# EAGLE design arduino (EAGLE 6.1)
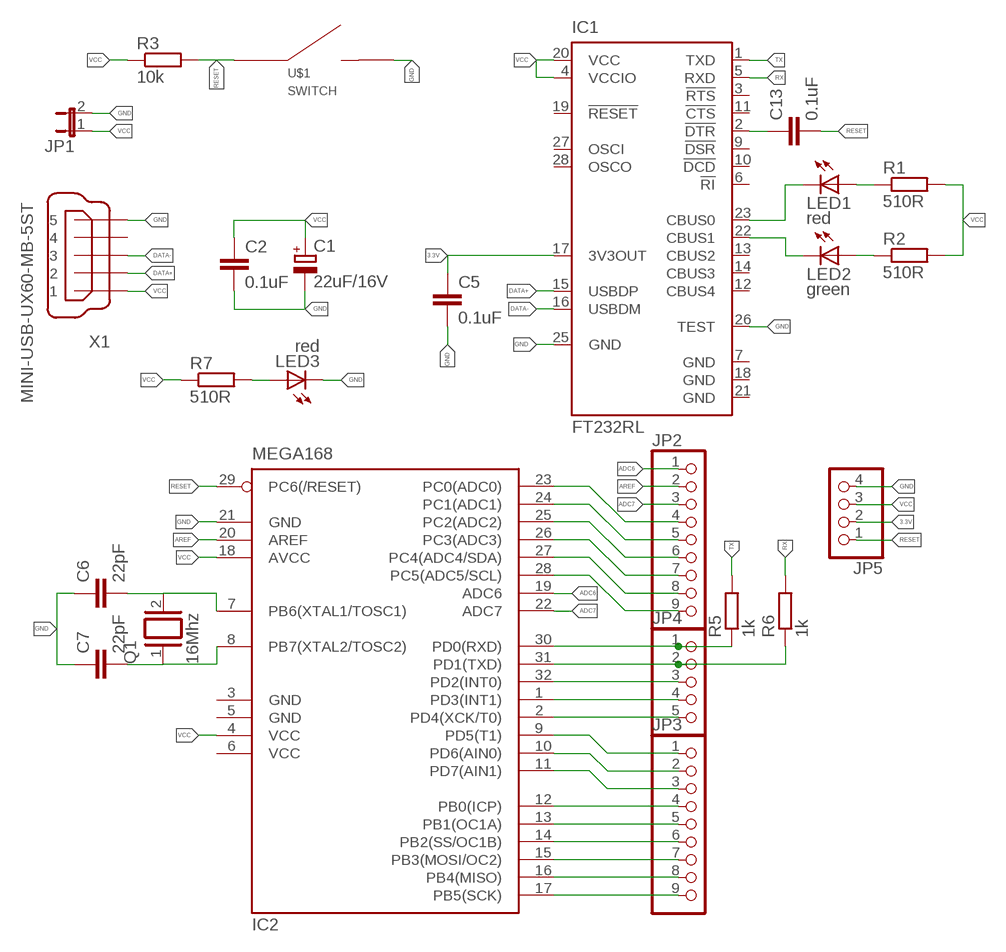
[diagram p0: schematic, sheet 1]

## Parts
C1  22uF/16V  CPOL-EUE2-5  [E2-5]
C2  0.1uF  C-EUC0805K  [C0805K]
C5  0.1uF  C-EUC0805K  [C0805K]
C6  22pF  C-EUC0805K  [C0805K]
C7  22pF  C-EUC0805K  [C0805K]
C13  0.1uF  C-EUC0805K  [C0805K]
IC1  FT232RL  [SSOP28]
IC2  MEGA168  MEGA8-AI  [TQFP32-08]
JP1  JP1E  [JP1]
JP2  PINHD-1X9  [1X09]
JP3  PINHD-1X9  [1X09]
JP4  PINHD-1X5  [1X05]
JP5  PINHD-1X4  [1X04]
LED1  red  LEDCHIPLED_1206  [CHIPLED_1206]
LED2  green  LEDCHIPLED_1206  [CHIPLED_1206]
LED3  red  LEDCHIPLED_1206  [CHIPLED_1206]
Q1  16Mhz  XTAL/S  [QS]
R1  510R  R-EU_R0805W  [R0805W]
R2  510R  R-EU_R0805W  [R0805W]
R3  10k  R-EU_R0805W  [R0805W]
R5  1k  R-EU_R0805W  [R0805W]
R6  1k  R-EU_R0805W  [R0805W]
R7  510R  R-EU_R0805W  [R0805W]
U$1  SWITCH  [SWITCH]
X1  MINI-USB-UX60-MB-5ST  [UX60-MB-5ST]

## Nets
3.3V: C5.1 IC1.17(3V3OUT) JP5.2
ADC6: IC2.19(ADC6) JP2.1
ADC7: IC2.22(ADC7) JP2.3
AREF: IC2.20(AREF) JP2.2
DATA+: IC1.15(USBDP) X1.2
DATA-: IC1.16(USBDM) X1.3
GND: C1.- C2.2 C5.2 C6.1 C7.1 IC1.25(GND) IC1.26(TEST) IC2.21(GND) JP1.2 JP5.4 LED3.C U$1.P2 X1.5
N$1: IC1.22(CBUS1) LED2.C
N$2: IC1.23(CBUS0) LED1.C
N$3: LED1.A R1.1
N$4: LED2.A R2.1
N$5: C13.1 IC1.2(!DTR)
N$6: C6.2 IC2.7(PB6(XTAL1/TOSC1)) Q1.2
N$7: C7.2 IC2.8(PB7(XTAL2/TOSC2)) Q1.1
N$8: IC2.23(PC0(ADC0)) JP2.4
N$9: IC2.30(PD0(RXD)) JP4.1 R5.1
N$10: IC2.31(PD1(TXD)) JP4.2 R6.1
N$11: LED3.A R7.2
N$12: IC2.24(PC1(ADC1)) JP2.5
N$13: IC2.25(PC2(ADC2)) JP2.6
N$14: IC2.26(PC3(ADC3)) JP2.7
N$15: IC2.27(PC4(ADC4/SDA)) JP2.8
N$16: IC2.28(PC5(ADC5/SCL)) JP2.9
N$17: IC2.11(PD7(AIN1)) JP3.3
N$18: IC2.10(PD6(AIN0)) JP3.2
N$19: IC2.12(PB0(ICP)) JP3.4
N$20: IC2.13(PB1(OC1A)) JP3.5
N$21: IC2.14(PB2(SS/OC1B)) JP3.6
N$22: IC2.15(PB3(MOSI/OC2)) JP3.7
N$23: IC2.16(PB4(MISO)) JP3.8
N$24: IC2.17(PB5(SCK)) JP3.9
N$25: IC2.9(PD5(T1)) JP3.1
N$27: IC2.32(PD2(INT0)) JP4.3
N$28: IC2.1(PD3(INT1)) JP4.4
N$29: IC2.2(PD4(XCK/T0)) JP4.5
RESET: C13.2 IC2.29(PC6(/RESET)) JP5.1 R3.2 U$1.P1
RX: IC1.5(RXD) R6.2
TX: IC1.1(TXD) R5.2
VCC: C1.+ C2.1 IC1.4(VCCIO) IC1.20(VCC) IC2.4(VCC) IC2.18(AVCC) JP1.1 JP5.3 R1.2 R2.2 R3.1 R7.1 X1.1
Unconnected: IC1.3(!RTS) IC1.6(!RI) IC1.9(!DSR) IC1.10(!DCD) IC1.11(!CTS) IC1.12(CBUS4) IC1.13(CBUS2) IC1.14(CBUS3) IC1.19(!RESET) IC1.27(OSCI) IC1.28(OSCO) X1.4

## Power pins joined to a net without a drawn wire
GND: IC1.7(GND) IC1.18(GND) IC1.21(GND) IC2.3(GND) IC2.5(GND)
VCC: IC2.6(VCC)

## Library data of the parts
C1 = resistor:CPOL-EU: POLARIZED CAPACITOR, European symbol
C2 C5-C7 C13 = resistor:C-EU: CAPACITOR, European symbol
IC1 = ftdichip:FT232R: Source: http://www.ftdichip.com/Documents/DataSheets/DS_FT232R_v104.pdf; MPN: FT232RL; OC_FARNELL: 1146032; OC_NEWARK: 91K9918
IC2 = atmel:MEGA8: MICROCONTROLLER 8 Kbytes FLASH, 1 kbytes SRAM, 512 bytes EEPROM, USART, 6-channel 10 bit ADC, 2-channel 8 bit ADC Pin compatible with Atmega48, ATMega88, ATMega168 Source: avr.lbr; MPN: ATMEGA8-16AU; OC_FARNELL: 9171371; OC_NEWARK: 73M8863
JP1 = jumper:JP1E: JUMPER
JP2 JP3 = pinhead:PINHD-1X9: PIN HEADER
JP4 = pinhead:PINHD-1X5: PIN HEADER
JP5 = pinhead:PINHD-1X4: PIN HEADER
LED1-LED3 = led:LED: LED OSRAM: - CHIPLED LG R971, LG N971, LY N971, LG Q971, LY Q971, LO R971, LY R971 LH N974, LH R974 LS Q976, LO Q976, LY Q976 LO Q996 - Hyper CHIPLED LW Q18S LB Q993, LB Q99A, LB R99A - SideLED LS A670, LO A670, LY A670, LG A670, LP A670 LB A673, LV A673, LT A673, LW A673 LH A674 LY A675 LS A676, LA A676, LO A676, LY A676, LW A676 LS A679, LY A679, LG A679 - Hyper Micro SIDELED® LS Y876, LA Y876, LO Y876, LY Y876 LT Y87S - SmartLED LW L88C, LW L88S LB L89C, LB L89S, LG L890 LS L89K, LO L89K, LY L89K LS L896, LA L896, LO L896, LY L896 - TOPLED LS T670, LO T670, LY T670, LG T670, LP T670 LSG T670, LSP T670, LSY T670, LOP T670, LYG T670 LG T671, LOG T671, LSG T671 LB T673, LV T673, LT T673, LW T673 LH T674 LS T676, LA T676, LO T676, LY T676, LB T676, LH T676, LSB T676, LW T676 LB T67C, LV T67C, LT T67C, LS T67K, LO T67K, LY T67K, LW E67C LS E67B, LA E67B, LO E67B, LY E67B, LB E67C, LV E67C, LT E67C LW T67C LS T679, LY T679, LG T679 LS T770, LO T770, LY T770, LG T770, LP T770 LB T773, LV T773, LT T773, LW T773 LH T774 LS E675, LA E675, LY E675, LS T675 LS T776, LA T776, LO T776, LY T776, LB T776 LHGB T686 LT T68C, LB T68C - Hyper Mini TOPLED® LB M676 - Mini TOPLED Santana® LG M470 LS M47K, LO M47K, LY M47K Source: http://www.osram.convergy.de LUXEON: - LUMILED® LXK2-PW12-R00, LXK2-PW12-S00, LXK2-PW14-U00, LXK2-PW14-V00 LXK2-PM12-R00, LXK2-PM12-S00, LXK2-PM14-U00 LXK2-PE12-Q00, LXK2-PE12-R00, LXK2-PE12-S00, LXK2-PE14-T00, LXK2-PE14-U00 LXK2-PB12-K00, LXK2-PB12-L00, LXK2-PB12-M00, LXK2-PB14-N00, LXK2-PB14-P00, LXK2-PB14-Q00 LXK2-PR12-L00, LXK2-PR12-M00, LXK2-PR14-Q00, LXK2-PR14-R00 LXK2-PD12-Q00, LXK2-PD12-R00, LXK2-PD12-S00 LXK2-PH12-R00, LXK2-PH12-S00 LXK2-PL12-P00, LXK2-PL12-Q00, LXK2-PL12-R00 Source: www.luxeon.com KINGBRIGHT: KA-3528ASYC Source: www.kingbright.com
Q1 = special:XTAL/S: CRYSTAL
R1-R3 R5-R7 = resistor:R-EU_: RESISTOR, European symbol
U$1 = switch:SWITCH
X1 = con-hirose:MINI-USB-: MINI USB Connector Source: http://www.hirose.co.jp/cataloge_hp/e24000019.pdf; OC_FARNELL: unknown; OC_NEWARK: unknown

## Board
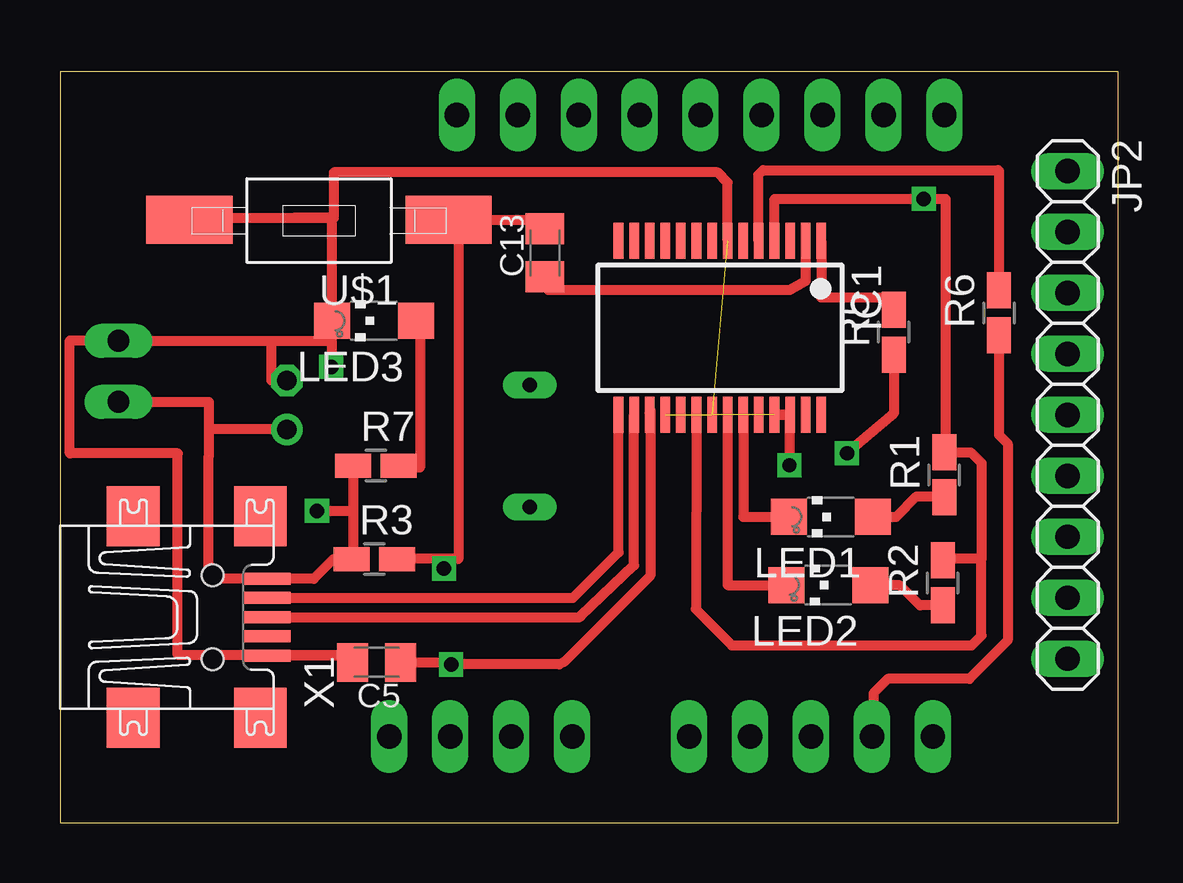
[diagram p1: board, top side]
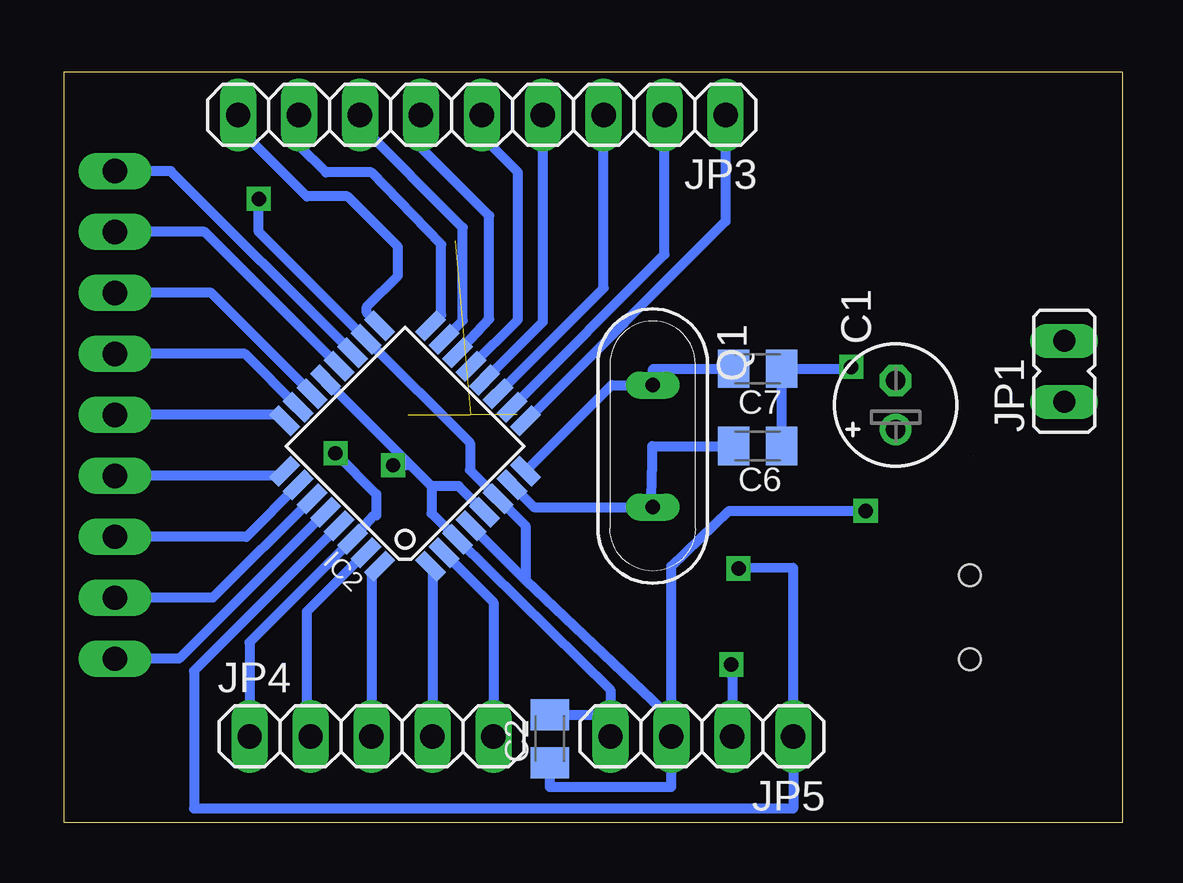
[diagram p2: board, bottom side, seen from below]

Size 44.1 x 31.3 mm. Coordinates in mm from the lower left corner, seen from the top.
Outline: 0,0 44.1,0 44.1,31.3 0,31.3 0,0
Copper layers (1*16): Top 0.035mm / dielectric 1.5mm / Bottom 0.035mm
Design rules: minimum track width 10mil, minimum drill 24mil, track to track 8mil, track to pad 8mil, pad to pad 8mil, via to via 8mil, smd to smd 8mil, copper to edge 40mil, drill to drill 8mil, minimum pad ring 10mil, minimum via ring 8mil, stop-mask expansion 4mil, vias tented up to drill 0mil, thermal gap 10mil

### Footprints (pad centres in the part's own frame; a part is rotated, then mirrored left to right if it is on the bottom)
E2-5 = drill 0.813 pad 1.27: + -1.016,0 | drill 0.813 pad 1.27 octagon: - 1.016,0
C0805K = smd 1.3 x 1.6: 1 -1,0; 2 1,0
SSOP28 = smd 0.4 x 1.5: 1 -4.225,-3.625; 2 -3.575,-3.625; 3 -2.925,-3.625; 4 -2.275,-3.625; 5 -1.625,-3.625; 6 -0.975,-3.625; 7 -0.325,-3.625; 8 0.325,-3.625; 9 0.975,-3.625; 10 1.625,-3.625; 11 2.275,-3.625; 12 2.925,-3.625; 13 3.575,-3.625; 14 4.225,-3.625; 15 4.225,3.625; 16 3.575,3.625; 17 2.925,3.625; 18 2.275,3.625; 19 1.625,3.625; 20 0.975,3.625; 21 0.325,3.625; 22 -0.325,3.625; 23 -0.975,3.625; 24 -1.625,3.625; 25 -2.275,3.625; 26 -2.925,3.625; 27 -3.575,3.625; 28 -4.225,3.625
TQFP32-08 = smd 1.27 x 0.559: 1 -4.293,2.8; 2 -4.293,2; 3 -4.293,1.2; 4 -4.293,0.4; 5 -4.293,-0.4; 6 -4.293,-1.2; 7 -4.293,-2; 8 -4.293,-2.8; 17 4.293,-2.8; 18 4.293,-2; 19 4.293,-1.2; 20 4.293,-0.4; 21 4.293,0.4; 22 4.293,1.2; 23 4.293,2; 24 4.293,2.8 | smd 0.559 x 1.27: 9 -2.8,-4.293; 10 -2,-4.293; 11 -1.2,-4.293; 12 -0.4,-4.293; 13 0.4,-4.293; 14 1.2,-4.293; 15 2,-4.293; 16 2.8,-4.293; 25 2.8,4.293; 26 2,4.293; 27 1.2,4.293; 28 0.4,4.293; 29 -0.4,4.293; 30 -1.2,4.293; 31 -2,4.293; 32 -2.8,4.293
JP1 = drill 0.914 long: 1 0,-1.27; 2 0,1.27
1X09 = drill 1.016 long: 1 -10.16,0; 2 -7.62,0; 3 -5.08,0; 4 -2.54,0; 5 0,0; 6 2.54,0; 7 5.08,0; 8 7.62,0; 9 10.16,0
1X05 = drill 1.016 long: 1 -5.08,0; 2 -2.54,0; 3 0,0; 4 2.54,0; 5 5.08,0
1X04 = drill 1.016 long: 1 -3.81,0; 2 -1.27,0; 3 1.27,0; 4 3.81,0
CHIPLED_1206 = smd 1.5 x 1.5: A 0,-1.75; C 0,1.75
QS = drill 0.61 long: 1 -2.54,0; 2 2.54,0
R0805W = smd 1.5 x 1: 1 -0.94,0; 2 0.94,0
SWITCH = smd 3.6 x 2: P1 -5.4,-0.1; P2 5.4,-0.1
UX60-MB-5ST = smd 2 x 0.5: 1 2.25,1.6; 2 2.25,0.8; 3 2.25,0; 4 2.25,-0.8; 5 2.25,-1.6 | smd 2.2 x 2.5: M1 -3.3,-4.2; M2 -3.3,4.2; M3 2,4.2; M4 2,-4.2 | hole 0.9: 0,-1.75; 0,1.75

### Placement (x,y rotation side)
C1  9.45,17.41 90 bottom
C2  23.87,3.51 90 bottom
C5  13.19,6.69 180 top
C6  15.2,15.7 180 bottom
C7  15.2,18.92 180 bottom
C13  20.21,23.75 90 top
IC1  27.5,20.63 180 top
IC2  29.9,15.7 135 bottom
JP1  2.43,18.81 0 bottom
JP2  42,17 270 top
JP3  26.7,29.5 180 bottom
JP4  31.3,3.6 0 bottom
JP5  17.53,3.6 180 bottom
LED1  32.12,12.75 90 top
LED2  32.02,9.91 90 top
LED3  13.08,20.92 90 top
Q1  19.58,15.7 270 bottom
R1  36.85,14.5 90 top
R2  36.79,10 90 top
R3  13.1,10.99 0 top
R5  34.75,20.45 90 top
R6  39.13,21.25 90 top
R7  13.16,14.89 0 top
U$1  10.79,25.04 180 top
X1  6.35,8.57 0 top

### Tracks (layer width: path | path; a pad name or v marks a point on that pad's centre or on a via)
3.3V  (via drill 0.6)
  Top 0.406: IC1.17 24.6,17.2 24.6,10.3 21,6.7 20.8,6.6 v16.3,6.6 16.3,6.69 | C5.1 16.3,6.69 | 16.3,6.69 16.39,6.69 16.4,6.7
  Bottom 0.406: v16.3,6.6 16.26,6.1 JP5.2
ADC6
  Bottom 0.406: IC2.19 39.66,27.16 JP2.1
ADC7
  Bottom 0.406: IC2.22 37.98,22.08 JP2.3
AREF
  Bottom 0.406: IC2.20 38.25,24.62 JP2.2
DATA+
  Top 0.406: IC1.15 23.27,11.28 21.37,9.37 X1.2
DATA-
  Top 0.406: IC1.16 23.93,10.72 21.7,8.6 21.67,8.57 X1.3
GND  (via drill 0.6)  (3 unrouted)
  Top 0.406: IC1.26 IC1.25 30.4,17 v30.4,14.9 | X1.5 11.78,6.99 | 11.78,6.99 C5.2 | IC1.7 27.82,26.68 27.4,27.1 11.4,27.1 11.4,25.2 8.1,25.2 | 8.1,25.2 5.45,25.2 U$1.P2 | 8.1,25.2 11.33,25.23 LED3.C 11.33,20.08 | 8.8,20.08 JP1.2 3.73,20.1 0.4,20.1 0.4,15.4 4.9,15.4 4.9,6.99 11.78,6.99 | 8.8,20.08 8.8,18.43 C1.- | 8.8,20.08 11.33,20.08 | v11.3,19 11.33,19 11.33,20.08
  Bottom 0.406: IC2.21 29.67,14.9 | 28.8,14.03 28.8,12.9 IC2.3 21.34,5.54 JP5.4 21.74,4.51 C2.2 | IC2.5 27.67,14.03 28.8,14.03 | C6.1 C7.1 11.3,18.92 v11.3,19 | v30.4,14.9 29.9,14.9 | 29.9,14.9 29.9,15.1 | 28.8,14.03 29.67,14.9 | 29.67,14.9 29.9,14.9
N$1
  Top 0.406: IC1.22 27.82,9.91 LED2.C
N$2
  Top 0.406: IC1.23 28.48,12.75 LED1.C
N$3
  Top 0.406: LED1.A 34.85,12.75 35.7,13.6 36.89,13.6 | 36.9,13.6 36.89,13.6 | 36.89,13.6 R1.1
N$4
  Top 0.406: R2.1 35.84,9.06 35,9.9 LED2.A
N$5
  Top 0.406: IC1.2 31.07,22.57 30.4,22.2 20.34,22.2 C13.1
N$6
  Bottom 0.406: IC2.7 24.53,13.16 Q1.2 19.62,13.2 19.6,14.7 19.6,15.7 C6.2
N$7
  Bottom 0.406: IC2.8 21.29,18.24 Q1.1 19.56,18.92 C7.2
N$8
  Bottom 0.406: IC2.23 36.57,19.54 JP2.4
N$9  (via drill 0.6)
  Top 0.406: R5.1 34.75,17.05 v32.8,15.4
  Bottom 0.406: JP4.1 36.38,7.52 IC2.30 31.2,12.8 31.1,12.8 31.1,13.7 v32.8,15.4
N$10
  Top 0.406: R6.1 39.13,16.17 39.5,15.8 39.5,7.6 37.9,6 34.5,6 33.9,5.4 33.9,3.66 JP4.2
  Bottom 0.406: IC2.31 31.55,11.25 34,8.8 34,3.76 JP4.2
N$11
  Top 0.406: LED3.A 15,21.42 15,14.8 14.1,14.8 R7.2
N$12
  Bottom 0.406: IC2.24 35.16,17 JP2.5
N$13
  Bottom 0.406: IC2.25 35.1,14.46 JP2.6
N$14
  Bottom 0.406: IC2.26 36.51,11.92 JP2.7
N$15
  Bottom 0.406: IC2.27 37.92,9.38 JP2.8
N$16
  Bottom 0.406: IC2.28 39.33,6.84 JP2.9
N$17
  Bottom 0.406: IC2.11 21.62,22.28 JP3.3
N$18
  Bottom 0.406: IC2.10 19.08,23.69 JP3.2
N$19
  Bottom 0.406: IC2.12 24.16,20.87 JP3.4
N$20
  Bottom 0.406: IC2.13 25.2,20.97 25.2,27.1 26.7,28.6 JP3.5
N$21
  Bottom 0.406: IC2.14 26.4,21 26.4,25.3 29.24,28.14 JP3.6
N$22
  Bottom 0.406: IC2.15 27.5,20.93 27.5,24.8 31.8,29.1 31.8,29.48 JP3.7
N$23
  Bottom 0.406: IC2.16 28.4,21.16 28.4,24.1 31.3,27.1 33.2,27.1 34.32,28.22 JP3.8
N$24
  Bottom 0.406: IC2.17 31.5,21.26 31.5,21.5 30.2,22.8 30.2,24 32.3,26.1 34,26.1 36.9,29 36.9,29.5 JP3.9
N$25
  Bottom 0.406: JP3.1 16.54,25.06 24.9,16.7 24.9,16.74 IC2.9
N$27
  Bottom 0.406: IC2.32 31.3,10.34 JP4.3
N$28
  Bottom 0.406: IC2.1 28.76,10.6 JP4.4
N$29
  Bottom 0.406: IC2.2 26.22,9.19 JP4.5
RESET  (via drill 0.6)
  Top 0.406: C13.2 19.91,24.49 19.9,24.5 19.84,25.14 U$1.P1 16.6,25.14 16.6,11 16,11 | v16,10.6 16,11 | 16,11 14.1,11 | 14.1,11 R3.2 14.04,10.96 14.1,10.9 14.1,11
  Bottom 0.406: IC2.29 38.7,6.33 38.7,0.6 13.72,0.6 JP5.1 13.72,10.62 v16,10.6
RX
  Top 0.406: IC1.5 29.1,24.28 29.1,27 29.3,27.2 39.1,27.2 39.13,27.17 R6.2
TX
  Top 0.406: IC1.1 31.73,21.9 34.2,21.9 34.8,21.3 34.8,21.34 R5.2
VCC  (via drill 0.6)  (1 unrouted)
  Top 0.406: IC1.4 29.77,26 v36,26 36.9,26 36.9,15.05 R1.2 37.96,15.44 38.4,15 38.4,11 | 6.2,15.29 6.2,10.17 X1.1 10.57,10.17 11.4,11 R3.1 12.19,10.99 12.22,11.02 12.22,13 | IC1.20 26.5,8.9 27.1,8.3 28,7.4 38,7.4 38.4,7.8 38.4,11 | 38.4,11 36.85,11 R2.2 | R7.1 12.22,13 | JP1.1 6.2,17.54 6.2,16.39 | 6.2,16.39 6.2,15.3 | C1.+ 6.2,16.39 | v10.7,13 12.22,13
  Bottom 0.406: IC2.6 27.2,14.7 27.2,15.83 IC2.18 36,24.63 v36,26 | IC2.6 | IC2.4 24.88,10.12 | 24.88,10.12 18.8,4.33 | 18.8,4.33 JP5.3 18.8,1.5 23.87,1.5 C2.1 | IC2.6 24.88,12.38 24.88,10.12 | 18.8,4.33 18.8,10.7 16.4,13 v10.7,13